# Altium schematic sheet TransceiversCanFD.SchDoc
size A4; SheetNumber: 6; SheetTotal: 12
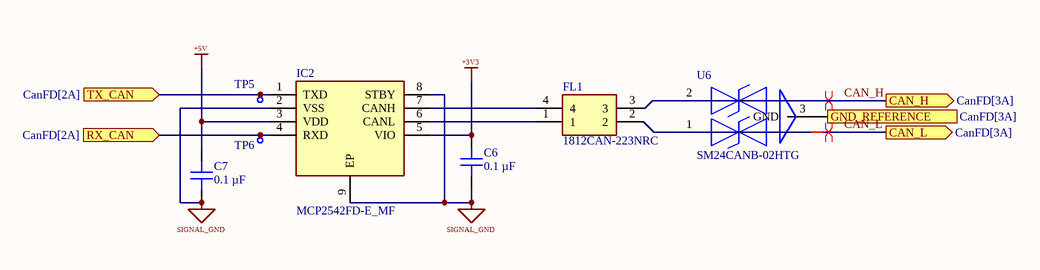
[diagram p0: TransceiversCanFD.SchDoc]

## Parts
C6  value 0.1 µF  [CAP 0805_2012]  (hidden comment: 0.1uF)
C7  value 0.1 µF  [CAP 0805_2012]  (hidden comment: 0.1uF)
FL1  1812CAN-223NRC  [1812CAN223NRC]
IC2  MCP2542FD-E_MF  [SON65P300X300X100-9N-D]
TP5  TestPad  [Test Pad Small]  (value not drawn)
TP6  TestPad  [Test Pad Small]  (value not drawn)
U6  SM24CANB-02HTG  [SOT23-3_SM24CANB-02HTG_LTF-L]

## Ports
CAN_H (out, see CanFD[3A]), CAN_L (out, see CanFD[3A]), GND_REFERENCE (in, see CanFD[3A]), RX_CAN (in, see CanFD[2A]), TX_CAN (in, see CanFD[2A])

## Nets
+3V3: C6.2 IC2.5(VIO)
+5V: C7.2 IC2.3(VDD)
SIGNAL_GND: C6.1 C7.1 IC2.2(VSS) IC2.8(STBY) IC2.9(EP)
CAN_H: FL1.3 U6.2(A) ; port CAN_H
CAN_L: FL1.2 U6.1(A) ; port CAN_L
GND_REFERENCE: U6.3(GND) ; port GND_REFERENCE
RX_CAN: IC2.4(RXD) TP6.P2 ; port RX_CAN
TX_CAN: IC2.1(TXD) TP5.P2 ; port TX_CAN
NetFL1_1: FL1.1 IC2.6(CANL)
NetFL1_4: FL1.4 IC2.7(CANH)

## Layout directives
differential pair: CAN_H, CAN_L

## Library data of the parts
C6 C7 = CC0805MRX7R9BB104: CAP CER 0.1UF 50V X7R 0805; manufacturer: Yageo; Tolerance: ±20%; Part Number: CC0805MRX7R9BB104; Applications: General Purpose; Capacitance: 0.1 µF; componentlink1description: Datasheet; componentlink1url: https://www.yageo.com/upload/media/product/productsearch/datasheet/mlcc/UPY-GPHC_X7R_6.3V-to-50V_18.pdf; componentlink2description: DigiKey Link; componentlink2url: https://www.digikey.com/en/products/detail/yageo/CC0805MRX7R9BB104/5884281; Device Package: 0805 (2012 Metric); lastupdated: 09/02/2024 20:16:09; Lifecycle Status: Active; Minimum Order: 1; Mounting Type: Surface Mount, MLCC; Operating Temperature: -55°C ~ 125°C; Package / Case: 0805 (2012 Metric); packaging: TapeAndReel; partid: 2475; Part Status: Active; price: 0.01; series: CC; Size / Dimension: 0.079" L x 0.049" W (2.00mm x 1.25mm); Supplier 1: DigiKey; Supplier Part Number 1: 311-4351-1-ND; Temperature Coefficient: X7R; Thickness (Max): 0.037" (0.95mm); Voltage - Rated: 50V
FL1 = 1812CAN-223NRC: Filter; Manufacturer_Name: COILCRAFT; Datasheet Link: https://www.coilcraft.com/getmedia/07970769-ca48-411d-9c96-6ae867bbb31e/1812can.pdf; Height: 3mm; Manufacturer_Part_Number: 1812CAN-223NRC; Mouser Part Number: 994-1812CAN-223NRC; Mouser Price/Stock: https://www.mouser.co.uk/ProductDetail/Coilcraft/1812CAN-223NRC?qs=wnTfsH77Xs58ULcmqHaGYA%3D%3D
IC2 = MCP2542FD-E_MF: Integrated Circuit; Manufacturer_Name: Microchip; Manufacturer_Part_Number: MCP2542FD-E/MF; Datasheet Link: http://ww1.microchip.com/downloads/en/devicedoc/20005514a.pdf; Height: 1mm; Mouser Part Number: 579-MCP2542FD-E/MF; Mouser Price/Stock: https://www.mouser.co.uk/ProductDetail/Microchip-Technology-Atmel/MCP2542FD-E-MF?qs=l7cgNqFNU1jog4BwTzULBw%3D%3D; Arrow Part Number: MCP2542FD-E/MF; Arrow Price/Stock: https://www.arrow.com/en/products/mcp2542fd-emf/microchip-technology?region=nac
U6 = SM24CANB-02HTG: No Description Available; Mfr_Name: Littelfuse Inc; RefDes: RefDes; Type: Type